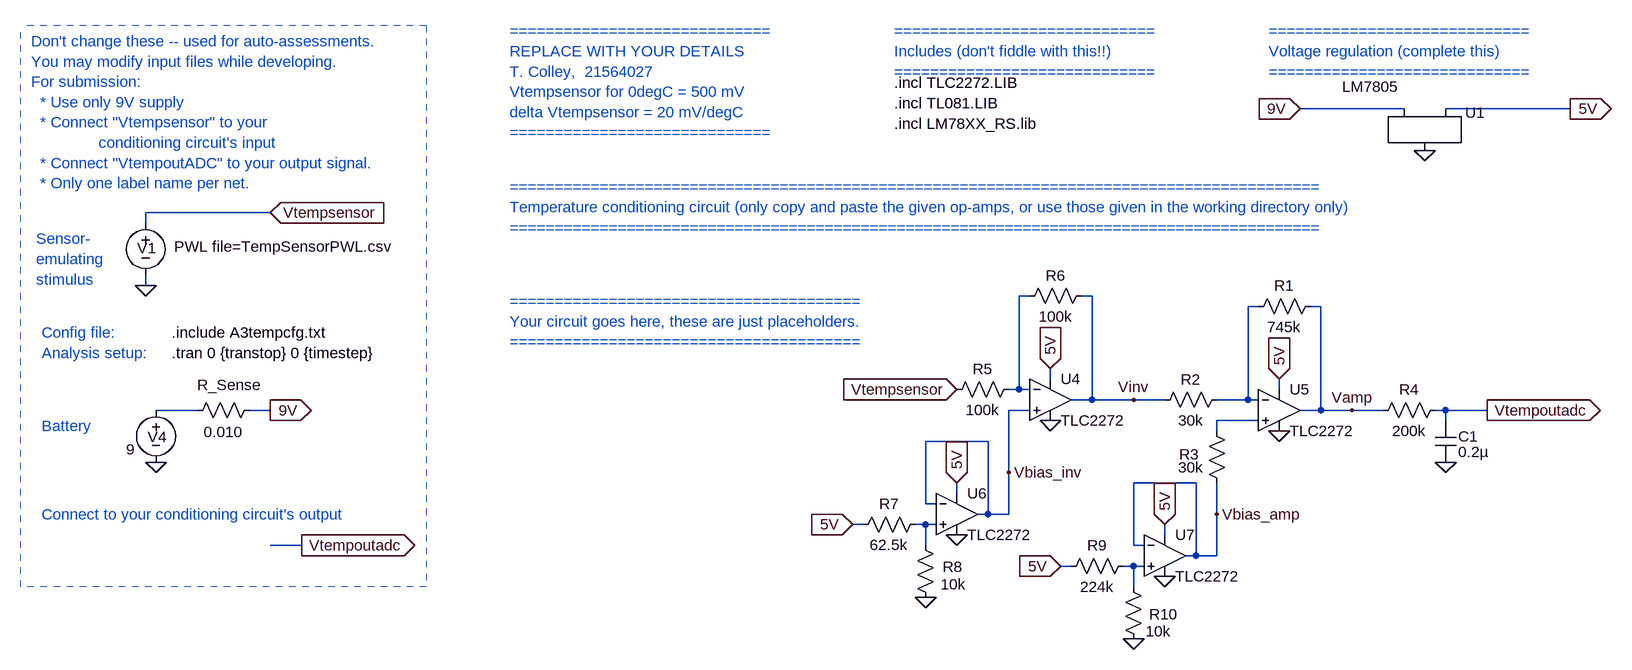
[diagram p0: schematic E344_A3_temp.asc]
E344_A3_temp.asc, the LTspice schematic file:
Version 4
SHEET 1 1824 680
WIRE -176 -1280 -336 -1280
WIRE 80 -1280 -112 -1280
WIRE -1920 -1120 -2112 -1120
WIRE -2112 -1104 -2112 -1120
WIRE -2112 -1008 -2112 -1024
WIRE -752 -992 -768 -992
WIRE -656 -992 -672 -992
WIRE -400 -976 -416 -976
WIRE -304 -976 -320 -976
WIRE -720 -864 -720 -880
WIRE -768 -848 -768 -992
WIRE -768 -848 -784 -848
WIRE -752 -848 -768 -848
WIRE -368 -848 -368 -864
WIRE -656 -832 -656 -992
WIRE -656 -832 -688 -832
WIRE -592 -832 -656 -832
WIRE -544 -832 -592 -832
WIRE -416 -832 -416 -976
WIRE -416 -832 -464 -832
WIRE -400 -832 -416 -832
WIRE -2032 -816 -2096 -816
WIRE -1920 -816 -1952 -816
WIRE -752 -816 -784 -816
WIRE -304 -816 -304 -976
WIRE -304 -816 -336 -816
WIRE -256 -816 -304 -816
WIRE -208 -816 -256 -816
WIRE -112 -816 -128 -816
WIRE -48 -816 -112 -816
WIRE -400 -800 -464 -800
WIRE -112 -800 -112 -816
WIRE -464 -784 -464 -800
WIRE -816 -768 -912 -768
WIRE -784 -720 -784 -816
WIRE -496 -704 -592 -704
WIRE -864 -688 -864 -704
WIRE -912 -672 -912 -768
WIRE -896 -672 -912 -672
WIRE -816 -656 -816 -768
WIRE -816 -656 -832 -656
WIRE -784 -656 -784 -720
WIRE -784 -656 -816 -656
WIRE -464 -656 -464 -704
WIRE -1008 -640 -1024 -640
WIRE -912 -640 -928 -640
WIRE -896 -640 -912 -640
WIRE -544 -624 -544 -640
WIRE -1872 -608 -1920 -608
WIRE -912 -608 -912 -640
WIRE -592 -608 -592 -704
WIRE -576 -608 -592 -608
WIRE -496 -592 -496 -704
WIRE -496 -592 -512 -592
WIRE -464 -592 -464 -656
WIRE -464 -592 -496 -592
WIRE -688 -576 -704 -576
WIRE -592 -576 -608 -576
WIRE -576 -576 -592 -576
WIRE -592 -544 -592 -576
FLAG -2112 -1008 0
FLAG -1920 -1120 Vtempsensor
IOPIN -1920 -1120 In
FLAG -1920 -816 9V
IOPIN -1920 -816 Out
FLAG -2096 -736 0
FLAG -336 -1280 9V
IOPIN -336 -1280 In
FLAG -144 -1216 0
FLAG 80 -1280 5V
IOPIN 80 -1280 Out
FLAG -1872 -608 Vtempoutadc
IOPIN -1872 -608 Out
FLAG -368 -784 0
FLAG -112 -736 0
FLAG -720 -800 0
FLAG -720 -880 5V
IOPIN -720 -880 In
FLAG -368 -864 5V
IOPIN -368 -864 In
FLAG -864 -624 0
FLAG -864 -704 5V
IOPIN -864 -704 In
FLAG -912 -528 0
FLAG -1024 -640 5V
IOPIN -1024 -640 In
FLAG -544 -560 0
FLAG -544 -640 5V
IOPIN -544 -640 In
FLAG -592 -464 0
FLAG -704 -576 5V
IOPIN -704 -576 In
FLAG -592 -832 Vinv
FLAG -784 -720 Vbias_inv
FLAG -464 -656 Vbias_amp
FLAG -256 -816 Vamp
FLAG -864 -848 Vtempsensor
IOPIN -864 -848 In
FLAG -48 -816 Vtempoutadc
IOPIN -48 -816 Out
SYMBOL voltage -2112 -1120 R0
WINDOW 123 0 0 Left 0
WINDOW 39 0 0 Left 0
WINDOW 3 44 52 Left 2
WINDOW 0 -13 54 Left 2
SYMATTR Value PWL file=TempSensorPWL.csv
SYMATTR InstName V1
SYMBOL voltage -2096 -832 R0
WINDOW 123 24 44 Left 2
WINDOW 39 0 0 Left 0
WINDOW 3 -46 76 Left 2
WINDOW 0 -13 57 Left 2
SYMATTR Value 9
SYMATTR InstName V4
SYMBOL res -1936 -832 R90
WINDOW 0 -7 47 VBottom 2
WINDOW 3 34 56 VTop 2
SYMATTR InstName R_Sense
SYMATTR Value 0.010
SYMBOL LM7805 -144 -1264 R0
WINDOW 3 -83 -66 Top 2
SYMATTR InstName U1
SYMBOL res -304 -992 R90
WINDOW 0 0 56 VBottom 2
WINDOW 3 32 56 VTop 2
SYMATTR InstName R1
SYMATTR Value 745k
SYMBOL res -448 -848 R90
WINDOW 0 0 56 VBottom 2
WINDOW 3 32 56 VTop 2
SYMATTR InstName R2
SYMATTR Value 30k
SYMBOL res -448 -688 R180
WINDOW 0 43 60 Left 2
WINDOW 3 36 40 Left 2
SYMATTR InstName R3
SYMATTR Value 30k
SYMBOL cap -96 -736 R180
WINDOW 0 -34 40 Left 2
WINDOW 3 -51 16 Left 2
SYMATTR InstName C1
SYMATTR Value 0.2µ
SYMBOL res -112 -832 R90
WINDOW 0 0 56 VBottom 2
WINDOW 3 32 56 VTop 2
SYMATTR InstName R4
SYMATTR Value 200k
SYMBOL res -768 -864 R90
WINDOW 0 0 56 VBottom 2
WINDOW 3 32 56 VTop 2
SYMATTR InstName R5
SYMATTR Value 100k
SYMBOL res -656 -1008 R90
WINDOW 0 0 56 VBottom 2
WINDOW 3 32 56 VTop 2
SYMATTR InstName R6
SYMATTR Value 100k
SYMBOL res -912 -656 R90
WINDOW 0 0 56 VBottom 2
WINDOW 3 32 56 VTop 2
SYMATTR InstName R7
SYMATTR Value 62.5k
SYMBOL res -928 -624 R0
WINDOW 0 42 49 Left 2
WINDOW 3 39 76 Left 2
SYMATTR InstName R8
SYMATTR Value 10k
SYMBOL res -592 -592 R90
WINDOW 0 0 56 VBottom 2
WINDOW 3 32 56 VTop 2
SYMATTR InstName R9
SYMATTR Value 224k
SYMBOL res -608 -560 R0
WINDOW 0 40 58 Left 2
WINDOW 3 35 84 Left 2
SYMATTR InstName R10
SYMATTR Value 10k
SYMBOL opamp2 -720 -896 R0
SYMATTR InstName U4
SYMATTR Value TLC2272
SYMATTR SpiceModel TLC2272
SYMBOL opamp2 -368 -880 R0
SYMATTR InstName U5
SYMATTR Value TLC2272
SYMATTR SpiceModel TLC2272
SYMBOL opamp2 -864 -720 R0
SYMATTR InstName U6
SYMATTR Value TLC2272
SYMATTR SpiceModel TLC2272
SYMBOL opamp2 -544 -656 R0
SYMATTR InstName U7
SYMATTR Value TLC2272
SYMATTR SpiceModel TLC2272
TEXT -2072 -904 Left 2 !.tran 0 {transtop} 0 {timestep}
TEXT -2072 -936 Left 2 !.include A3tempcfg.txt
TEXT -2288 -1384 Left 2 ;Don't change these -- used for auto-assessments.\nYou may modify input files while developing.\nFor submission: \n  * Use only 9V supply \n  * Connect "Vtempsensor" to your \n               conditioning circuit's input\n  * Connect "VtempoutADC" to your output signal.\n  * Only one label name per net.
TEXT -2272 -936 Left 2 ;Config file:
TEXT -2272 -904 Left 2 ;Analysis setup:
TEXT -2272 -792 Left 2 ;Battery
TEXT -2280 -1080 Left 2 ;Sensor-\nemulating \nstimulus
TEXT -1552 -1400 Left 2 ;=============================\nREPLACE WITH YOUR DETAILS\nT. Colley,  21564027\nVtempsensor for 0degC = 500 mV\ndelta Vtempsensor = 20 mV/degC\n=============================
TEXT -1552 -1160 Left 2 ;==========================================================================================\nTemperature conditioning circuit (only copy and paste the given op-amps, or use those given in the working directory only)\n==========================================================================================
TEXT -384 -1400 Left 2 ;=============================\nVoltage regulation (complete this)\n=============================
TEXT -960 -1320 Left 2 !.incl TLC2272.LIB\n.incl TL081.LIB\n.incl LM78XX_RS.lib
TEXT -2272 -656 Left 2 ;Connect to your conditioning circuit's output
TEXT -960 -1400 Left 2 ;=============================\nIncludes (don't fiddle with this!!)\n=============================
TEXT -1552 -984 Left 2 ;=======================================\nYour circuit goes here, these are just placeholders.\n=======================================
LINE Normal -2304 -544 -2304 -1408 1
LINE Normal -1680 -1408 -1680 -544 1
LINE Normal -1680 -544 -2304 -544 1
LINE Normal -1680 -1408 -2304 -1408 1

The netlist it stands for:
* E344_A3_temp.asc
V1 Vtempsensor 0 PWL file=TempSensorPWL.csv
V4 N003 0 9
R_Sense 9V N003 0.010
XU1 9V 0 5V LM7805
R1 Vamp N002 745k
R2 N002 Vinv 30k
R3 Vbias_amp N004 30k
C1 0 Vtempoutadc 0.2µ
R4 Vtempoutadc Vamp 200k
R5 N001 Vtempsensor 100k
R6 Vinv N001 100k
R7 N005 5V 62.5k
R8 N005 0 10k
R9 N006 5V 224k
R10 N006 0 10k
XU4 Vbias_inv N001 5V 0 Vinv TLC2272 TLC2272  ; pins In+ In- V+ V- OUT
XU5 N004 N002 5V 0 Vamp TLC2272 TLC2272  ; pins In+ In- V+ V- OUT
XU6 N005 Vbias_inv 5V 0 Vbias_inv TLC2272 TLC2272  ; pins In+ In- V+ V- OUT
XU7 N006 Vbias_amp 5V 0 Vbias_amp TLC2272 TLC2272  ; pins In+ In- V+ V- OUT
.tran 0 {transtop} 0 {timestep}
.include A3tempcfg.txt
* Don't change these -- used for auto-assessments.
* You may modify input files while developing.
* For submission:
*   * Use only 9V supply
*   * Connect "Vtempsensor" to your
*                conditioning circuit's input
*   * Connect "VtempoutADC" to your output signal.
*   * Only one label name per net.
* Config file:
* Analysis setup:
* Battery
* Sensor-
* emulating
* stimulus
* =============================
* REPLACE WITH YOUR DETAILS
* T. Colley,  21564027
* Vtempsensor for 0degC = 500 mV
* delta Vtempsensor = 20 mV/degC
* =============================
* ==========================================================================================
* Temperature conditioning circuit (only copy and paste the given op-amps, or use those given in the working directory only)
* ==========================================================================================
* =============================
* Voltage regulation (complete this)
* =============================
.incl TLC2272.LIB
.incl TL081.LIB
.incl LM78XX_RS.lib
* Connect to your conditioning circuit's output
* =============================
* Includes (don't fiddle with this!!)
* =============================
* =======================================
* Your circuit goes here, these are just placeholders.
* =======================================
.backanno
.end